# EAGLE design Adafruit Hallowing M0 Express (EAGLE 9.0.1)
COMPANY: ADAFRUIT INDUSTRIES; DRAWN: KTOWN; REV: B
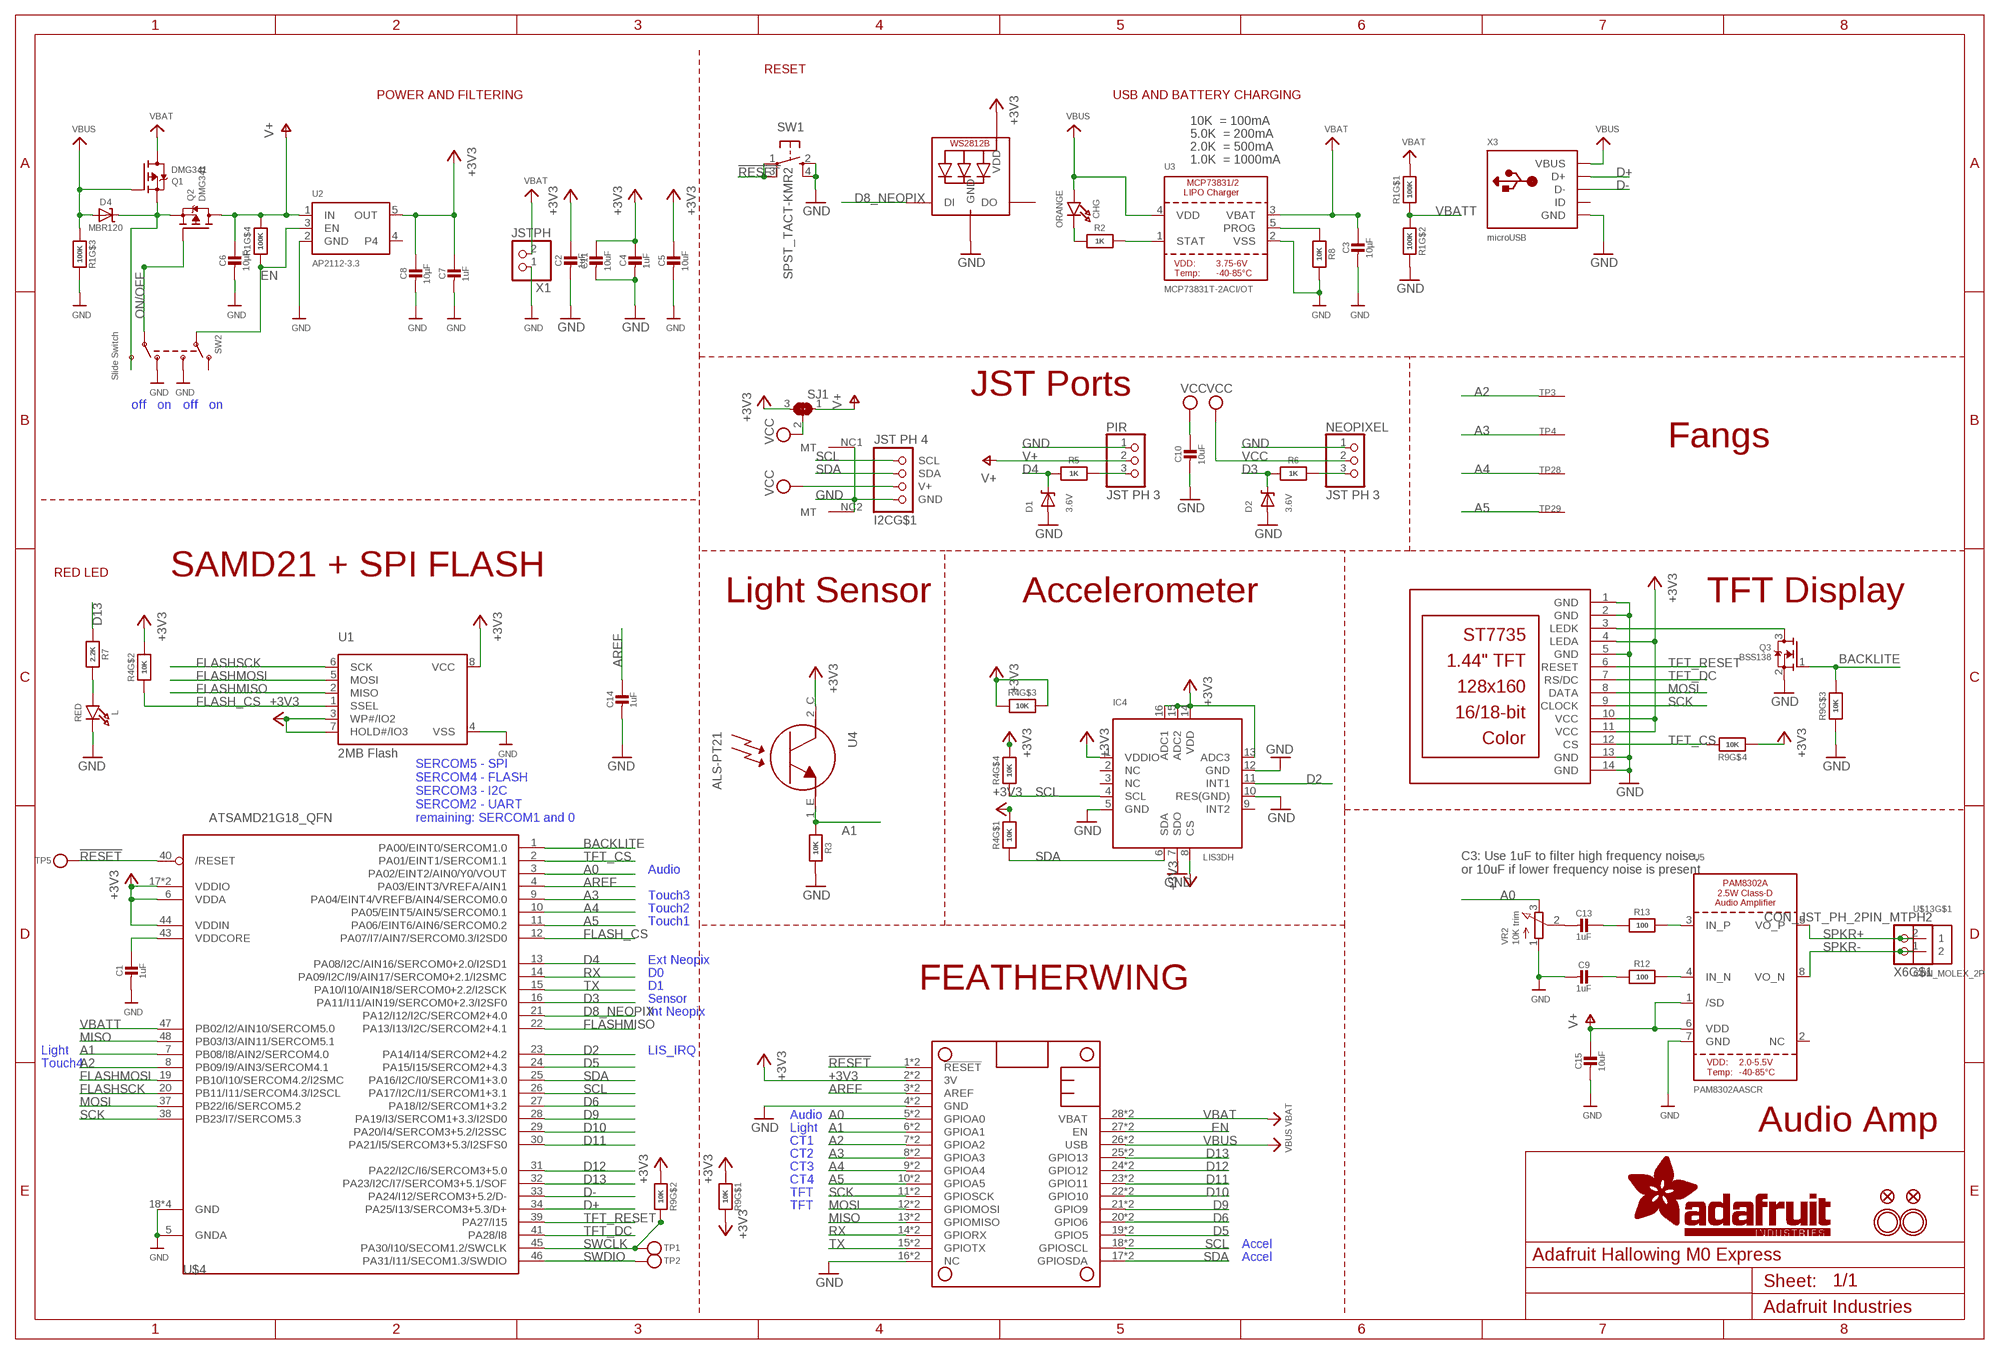
[diagram p0: schematic, sheet 1]

## Parts
C1  1uF  CAP_CERAMIC0603_NO  [0603-NO]
C2  1uF  CAP_CERAMIC0603_NO  [0603-NO]
C3  10µF  CAP_CERAMIC0805-NOOUTLINE  [0805-NO]
C4  1uF  CAP_CERAMIC0603_NO  [0603-NO]
C5  10uF  CAP_CERAMIC0805-NOOUTLINE  [0805-NO]
C6  10µF  CAP_CERAMIC0805-NOOUTLINE  [0805-NO]
C7  1uF  CAP_CERAMIC0603_NO  [0603-NO]
C8  10µF  CAP_CERAMIC0805_10MGAP  [0805_10MGAP]
C9  1uF  CAP_CERAMIC0603_NO  [0603-NO]
C10  10uF  CAP_CERAMIC0805-NOOUTLINE  [0805-NO]
C11  10uF  CAP_CERAMIC0805_10MGAP  [0805_10MGAP]
C13  1uF  CAP_CERAMIC0603_NO  [0603-NO]
C14  1uF  CAP_CERAMIC0603_NO  [0603-NO]
C15  10uF  CAP_CERAMIC0805-NOOUTLINE  [0805-NO]
CHG  ORANGE  LED0805_NOOUTLINE  [CHIPLED_0805_NOOUTLINE]
D1  3.6V  DIODE-ZENERSOD323  [SOD-323]
D2  3.6V  DIODE-ZENERSOD323  [SOD-323]
D4  MBR120  DIODE-SCHOTTKYSOD-123  [SOD-123]
I2C  JST PH 4  STEMMA_I2C_RASMT  [JSTPH4]
IC4  LIS3DH  ACCEL_LIS3DHTR  [LGA16_3X3MM]
L  RED  LED0805_NOOUTLINE  [CHIPLED_0805_NOOUTLINE]
LED1  WS2812B3535  [LED3535]
MS1  FEATHERWING_SMTDUALNOHOLES  [FEATHERWING_SMT_NOHOLES]
NEOPIXEL  JST PH 3  CON_JST_PH_3PIN  [JSTPH3]
PIR  JST PH 3  CON_JST_PH_3PIN  [JSTPH3]
Q1  DMG341  MOSFET-P  [SOT23-R]
Q2  DMG341  MOSFET-P  [SOT23-R]
Q3  BSS138  MOSFET-NWIDE  [SOT23-WIDE]
R1  100K  RESISTOR_4PACK  [RESPACK_4X0603]
R2  1K  RESISTOR_0603_NOOUT  [0603-NO]
R3  10K  RESISTOR_0603_NOOUT  [0603-NO]
R4  10K  RESISTOR_4PACK  [RESPACK_4X0603]
R5  1K  RESISTOR_0603_NOOUT  [0603-NO]
R6  1K  RESISTOR_0603_NOOUT  [0603-NO]
R7  2.2K  RESISTOR_0603_NOOUT  [0603-NO]
R8  10K  RESISTOR_0603_NOOUT  [0603-NO]
R9  10K  RESISTOR_4PACK  [RESPACK_4X0603]
R12  100  RESISTOR_0603_NOOUT  [0603-NO]
R13  100  RESISTOR_0603_NOOUT  [0603-NO]
SJ1  SOLDERJUMPER_2WAY  [SOLDERJUMPER_2WAY_OPEN_NOPASTE]
SW1  SPST_TACT-KMR2  [KMR2]
SW2  Slide Switch  SWITCH_DPDTEG1390  [EG1390]
TFT  DISP_LCD_ST7735_1.44IN  [TFT_1.44IN_128_128]
TP1  TESTPOINTROUND1.5MM  [TESTPOINT_ROUND_1.5MM]
TP2  TESTPOINTROUND1.5MM  [TESTPOINT_ROUND_1.5MM]
TP3  SEWTAP_ALLILONG  [PCB_ALLI_LONG]
TP4  SEWTAPPCB_ALLIGATOR  [PCB_ALLI]
TP5  TESTPOINTROUND1.5MM  [TESTPOINT_ROUND_1.5MM]
TP28  SEWTAPPCB_ALLIGATOR  [PCB_ALLI]
TP29  SEWTAP_ALLILONG  [PCB_ALLI_LONG]
U1  2MB Flash  SPIFLASH_8PIN208MIL  [SOIC8_208MIL]
U2  AP2112-3.3  VREG_SOT23-5  [SOT23-5]
U3  MCP73831T-2ACI/OT  MCP73831/2  [SOT23-5]
U4  ALS-PT21  PHOTOTRANSISTOR_PT26-21C  [ALS-PT26-21C]
U5  PAM8302AASCR  AUDIOAMP_PAM8302A  [MSOP8_0.65MM]
U$4  ATSAMD21G18_QFN  ATSAMD21G_QFN  [TQFN48_7MM]
U$13  CON_MOLEX_2P  [53398-0271]
U$31  MOUNTINGHOLE2.5  [MOUNTINGHOLE_2.5_PLATED]
U$32  MOUNTINGHOLE2.5  [MOUNTINGHOLE_2.5_PLATED]
U$34  FIDUCIAL_1MM  [FIDUCIAL_1MM]
U$35  FIDUCIAL_1MM  [FIDUCIAL_1MM]
VR2  10K trim  TRIMPOT3303W/X  [TRIMPOT_BOURNS_3303W]
X1  JSTPH  CON_JST_PH_2PIN  [JSTPH2]
X3  microUSB  USB_MICRO_20329_V2  [4UCONN_20329_V2]
X6  CON_JST_PH_2PIN_MTPH2  [JSTPH2]

## Nets
!RESET: MS1.1'(!RESET) MS1.1(!RESET) SW1.1(P) SW1.3(P1) TP5.P$1 U$4.40(/RESET)
+3V3 [power]: C2.1 C4.1 C5.1 C7.1 C8.1 C11.1 IC4.1(VDDIO) IC4.8(CS) IC4.13(ADC3) IC4.14(VDD) IC4.15(ADC2) IC4.16(ADC1) LED1.2(VDD) MS1.2'(3V) MS1.2(3V) R4.3 R4.5 R4.6 R4.7 R4.8 R9.1 R9.2 R9.4 R9.8 SJ1.3 TFT.4(LEDA) TFT.10(VCC) TFT.11(VCC) U1.3(WP#/IO2) U1.7(HOLD#/IO3) U1.8(VCC) U2.5(OUT) U4.2_C(C) U$4.6(VDDA) U$4.17(VDDIO) U$4.36(VDDIO) U$4.44(VDDIN)
A0: MS1.5'(GPIOA0) MS1.5(GPIOA0) U$4.3(PA02/EINT2/AIN0/Y0/VOUT) VR2.3(E)
A1: MS1.6'(GPIOA1) MS1.6(GPIOA1) R3.2 U4.1_E(E) U$4.7(PB08/I8/AIN2/SERCOM4.0)
A2: MS1.7'(GPIOA2) MS1.7(GPIOA2) TP3.P$1(SEW) U$4.8(PB09/I9/AIN3/SERCOM4.1)
A3: MS1.8'(GPIOA3) MS1.8(GPIOA3) TP4.P$1(SEW) U$4.9(PA04/EINT4/VREFB/AIN4/SERCOM0.0)
A4: MS1.9'(GPIOA4) MS1.9(GPIOA4) TP28.P$1(SEW) U$4.10(PA05/EINT5/AIN5/SERCOM0.1)
A5: MS1.10'(GPIOA5) MS1.10(GPIOA5) TP29.P$1(SEW) U$4.11(PA06/EINT6/AIN6/SERCOM0.2)
AREF: C14.1 MS1.3'(AREF) MS1.3(AREF) U$4.4(PA03/EINT3/VREFA/AIN1)
BACKLITE: Q3.1(G) R9.6 U$4.1(PA00/EINT0/SERCOM1.0)
CHG_LED: R2.2 U3.1(STAT)
CHG_RATE: R8.1 U3.5(PROG)
D2: IC4.11(INT1) U$4.23(PA14/I14/SERCOM2+4.2)
D3: D2.C R6.2 U$4.16(PA11/I11/AIN19/SERCOM0+2.3/I2SF0)
D4: D1.C R5.2 U$4.13(PA08/I2C/AIN16/SERCOM0+2.0/I2SD1)
D5: MS1.19'(GPIO5) MS1.19(GPIO5) U$4.24(PA15/I15/SERCOM2+4.3)
D6: MS1.20'(GPIO6) MS1.20(GPIO6) U$4.27(PA18/I2/SERCOM1+3.2)
D8_NEOPIX: LED1.1(DI) U$4.21(PA12/I12/I2C/SERCOM2+4.0)
D9: MS1.21'(GPIO9) MS1.21(GPIO9) U$4.28(PA19/I3/SERCOM1+3.3/I2SD0)
D10: MS1.22'(GPIO10) MS1.22(GPIO10) U$4.29(PA20/I4/SERCOM3+5.2/I2SSC)
D11: MS1.23'(GPIO11) MS1.23(GPIO11) U$4.30(PA21/I5/SERCOM3+5.3/I2SFS0)
D12: MS1.24'(GPIO12) MS1.24(GPIO12) U$4.31(PA22/I2C/I6/SERCOM3+5.0)
D13: MS1.25'(GPIO13) MS1.25(GPIO13) R7.1 U$4.32(PA23/I2C/I7/SERCOM3+5.1/SOF)
D+: U$4.34(PA25/I13/SERCOM3+5.3/D+) X3.D+
D-: U$4.33(PA24/I12/SERCOM3+5.2/D-) X3.D-
EN: MS1.27'(EN) MS1.27(EN) R1.4 SW2.P1 U2.3(EN)
FLASH_CS: R4.2 U1.1(SSEL) U$4.12(PA07/I7/AIN7/SERCOM0.3/I2SD0)
FLASHMISO: U1.2(MISO) U$4.22(PA13/I13/I2C/SERCOM2+4.1)
FLASHMOSI: U1.5(MOSI) U$4.19(PB10/I10/SERCOM4.2/I2SMC)
FLASHSCK: U1.6(SCK) U$4.20(PB11/I11/SERCOM4.3/I2SCL)
GND: C1.2 C2.2 C3.2 C4.2 C5.2 C6.2 C7.2 C8.2 C9.2 C10.2 C11.2 C14.2 C15.2 D1.A D2.A I2C.1(GND) I2C.NC1(MT) I2C.NC2(MT) IC4.5(GND) IC4.7(SDO) IC4.10(RES(GND)) IC4.12(GND) L.C LED1.4(GND) MS1.4'(GND) MS1.4(GND) MS1.16'(NC) MS1.16(NC) NEOPIXEL.1 PIR.1 Q3.2(S) R1.6 R1.7 R3.1 R8.2 R9.3 SW1.2(S) SW1.4(S1) SW2.O2 SW2.S1 TFT.1(GND) TFT.2(GND) TFT.5(GND) TFT.13(GND) TFT.14(GND) U1.4(VSS) U2.2(GND) U3.2(VSS) U5.7(GND) U$4.5(GNDA) U$4.18(GND) U$4.35(GND) U$4.42(GND) U$4.THERMAL(GND) VR2.1(A) X1.1 X3.BASE@1(GND) X3.BASE@2(GND) X3.GND X3.SPRT@1(GND) X3.SPRT@2(GND) X3.SPRT@3(GND) X3.SPRT@4(GND)
MISO: MS1.13'(GPIOMISO) MS1.13(GPIOMISO) U$4.48(PB03/I3/AIN11/SERCOM5.1)
MOSI: MS1.12'(GPIOMOSI) MS1.12(GPIOMOSI) TFT.8(DATA) U$4.37(PB22/I6/SERCOM5.2)
N$1: CHG.C R2.1
N$2: L.A R7.2
N$6: Q3.3(D) TFT.3(LEDK)
N$8: D4.C Q1.2(S) Q2.2(S) SW2.S2
N$19: R12.2 U5.4(IN_N)
N$20: R13.2 U5.3(IN_P)
N$21: C9.1 R12.1
N$22: C13.1 R13.1
N$23: C13.2 VR2.2(S)
NEOPIXELOUT: NEOPIXEL.3 R6.1
ON/OFF: Q2.1(G) SW2.P2
RX: MS1.14'(GPIORX) MS1.14(GPIORX) U$4.14(PA09/I2C/I9/AIN17/SERCOM0+2.1/I2SMC)
SCK: MS1.11'(GPIOSCK) MS1.11(GPIOSCK) TFT.9(CLOCK) U$4.38(PB23/I7/SERCOM5.3)
SCL: I2C.4(SCL) IC4.4(SCL) MS1.18'(GPIOSCL) MS1.18(GPIOSCL) R4.4 U$4.26(PA17/I2C/I1/SERCOM1+3.1)
SDA: I2C.3(SDA) IC4.6(SDA) MS1.17'(GPIOSDA) MS1.17(GPIOSDA) R4.1 U$4.25(PA16/I2C/I0/SERCOM1+3.0)
SENSORIN: PIR.3 R5.1
SPKR+: U5.5(VO_P) U$13.1 X6.2
SPKR-: U5.8(VO_N) U$13.2 X6.1
SWCLK: R9.7 TP1.P$1 U$4.45(PA30/I10/SECOM1.2/SWCLK)
SWDIO: TP2.P$1 U$4.46(PA31/I11/SECOM1.3/SWDIO)
TFT_CS: R9.5 TFT.12(CS) U$4.2(PA01/EINT1/SERCOM1.1)
TFT_DC: TFT.7(RS/DC) U$4.41(PA28/I8)
TFT_RESET: TFT.6(RESET) U$4.39(PA27/I15)
TX: MS1.15'(GPIOTX) MS1.15(GPIOTX) U$4.15(PA10/I10/AIN18/SERCOM0+2.2/I2SCK)
V+ [power]: C6.1 C15.1 PIR.2 Q2.3(D) R1.5 SJ1.1 U2.1(IN) U5.1(/SD) U5.6(VDD)
VBAT [power]: C3.1 MS1.28'(VBAT) MS1.28(VBAT) Q1.3(D) R1.8 U3.3(VBAT) X1.2
VBATT: R1.1 R1.2 U$4.47(PB02/I2/AIN10/SERCOM5.0)
VBUS [power]: CHG.A D4.A MS1.26'(USB) MS1.26(USB) Q1.1(G) R1.3 U3.4(VDD) X3.VBUS
VCC [power]: C10.1 I2C.2(V+) NEOPIXEL.2 SJ1.2
VDDCORE: C1.1 U$4.43(VDDCORE)
Unconnected: IC4.2(NC) IC4.3(NC) IC4.9(INT2) LED1.3(DO) SW2.O1 U2.4 U5.2(NC) U$13.M1(MT) U$13.M2(MT) X3.ID X6.NC1 X6.NC2

## Notes on the sheet
- RESET
- POWER AND FILTERING | USB AND BATTERY CHARGING
- 10K  = 100mA
- 5.0K  = 200mA
- 2.0K  = 500mA
- 1.0K  = 1000mA
- JST Ports
- off | on | off | on
- Fangs
- RED LED | SAMD21 + SPI FLASH
- Light Sensor | Accelerometer | TFT Display
- SERCOM5 - SPI
  SERCOM4 - FLASH
  SERCOM3 - I2C
  SERCOM2 - UART
  remaining: SERCOM1 and 0
- Audio
- C3: Use 1uF to filter high frequency noise,
  or 10uF if lower frequency noise is present
- Touch3
- Touch2
- Touch1
- Ext Neopix
- D0
- D1 | FEATHERWING
- Sensor
- Int Neopix
- Light | LIS_IRQ
- Touch4
- Audio
- Light | Audio Amp
- CT1
- CT2
- CT3
- CT4
- TFT
- TFT
- Accel
- Accel

## Library data of the parts
C1-C11 C13-C15 = microbuilder:CAP_CERAMIC: Ceramic Capacitors For new designs, use the packages preceded by an '_' character since they are more reliable: The following footprints should be used on most boards: _0402 - Standard footprint for regular board layouts _0603 - Standard footprint for regular board layouts _0805 - Standard footprint for regular board layouts _1206 - Standard footprint for regular board layouts For extremely tight-pitch boards where space is at a premium, the following 'micro-pitch' footprints can be used (smaller pads, no silkscreen outline, etc.): _0402MP - Micro-pitch footprint for very dense/compact boards _0603MP - Micro-pitch footprint for very dense/compact boards _0805MP - Micro-pitch footprint for very dense/compact boards _1206MP - Micro-pitch footprint for very dense/compact boards
CHG L = microbuilder:LED: LED 0603 - 0603 Surface Mount Package 2mA: Green LED - Low Power (3.9mcd, 2ma, 1.7Vf) - Digikey: 475-2709-2-ND Orange LED - Low Power (9.8mcd, 2ma, 1.8Vf) - Digikey: 475-1194-2-ND Red LED - Low Power (5mcd, 2ma, 1.8Vf) - Digikey: 475-1195-2-ND Yellow LED - Low Power (7mcd, 2ma, 1.8Vf) - Digikey: 475-1196-2-ND 5mA: Blue LED - Low Power (17mcd, 5ma, 2.9Vf) - Digikey: LNJ937W8CRACT-ND 0805 - 0805 Surface Mount Package 2mA: Red LED (8.8mcd, 2mA, 1.8Vf, Clear) - Low Power [Digikey: 475-2510-1-ND] Green LED (5mcd, 2mA, 1.8Vf, Clear) - Low Power [Digikey: 475-2730-1-ND] Yellow LED (11.3mcd, 2mA, 1.8Vf, Clear) - Low Power [Digikey: 475-2555-1-ND] 20mA: Red LED (104mcd, 20mA, Diffused) - LS R976 [Digikey: 475-1278-6-ND] Red LED (12mcd, 20mA, 2.0Vf, Clear) - APT2012EC [Digikey: 754-1128-1-ND] Green LED (15mcd, 20mA, 2.2Vf, Clear) - APT2012GC [Digikey: 754-1131-1-ND] Orange LED (160mcd, 20mA, 2.1Vf, Clear) - APT2012SECK [Digikey: 754-1130-1-ND] 1206 - 1206 Surface Mount Package Green LED (26mcd, 20mA, Diffused) - LG N971 [Digikey: 475-1407-6-ND] Red LED (15mcd, 20mA, Diffused) - LH N974 [Digikey: 475-1416-6-ND] Cree - Cree High-Power Surface Mount LEDs XPEBWT-L1-0000-00D50 - White 111lm 350mA 2.9Vf 6200K 110° XTEAWT-00-0000-00000LEE3 - White 114lm 350mA 2.85Vf 5000K 115° Everlight - Everlight 45-21 Series Surface Mount LEDs 45-21/QK2C-B2832AC2CB2/2T - Warm White 2000mcd 20mA 3.25Vf 3050K 120° 45-21/LK2C-B38452C4CB2/2T - Nuetral White 2000mcd 20mA 3.25Vf 4150K 120° 45-21/LK2C-B50634C6CB2/2T - Cold White 2200mcd 20mA 3.25Vf 5650K 120° PLCC2 Reverse Mount LS T77K-J1L2-1-0-2-R18-Z - Red 11.25mcd 2mA 1.8Vf 630nm 120° LO T77K-L1M2-24-Z - Orange 19.6mcd 2mA 1.8Vf 606nm 120° LY T77K-K2M1-26-Z - Yellow 15.7mcd 2mA 1.8Vf 587nm 120°
D1 D2 = microbuilder:DIODE-ZENER: Zener Diode SMA: 30V 1W Zener Diode, 1.2Vf - Digikey: SMAZ30-FDICT-ND
D4 = microbuilder:DIODE-SCHOTTKY
I2C = microbuilder:STEMMA_I2C
IC4 = microbuilder:ACCEL_LIS3DHTR: LIS3DHTR 3-Axis Accelerometer with I2C/SPI Interface VDD: 1.71-3.6V VDDIO: 1.71-VDD+0.1V Scale: +/-2g, 4g, 8g, 16g with 16--bit data output Temp:: -40°C - 85°C Mouser: 511-LIS3DHTR Digikey: 497-10613-1-ND
LED1 = microbuilder:WS2812B
MS1 = microbuilder:FEATHERWING
NEOPIXEL PIR = microbuilder:CON_JST_PH_3PIN
Q1 Q2 = microbuilder:MOSFET-P: P-Channel Mosfet LEGEND VDS: Voltage Drain-Source ID: Drain Current RDS(ON): Drain-Source On-State Resistance VGS(TH): Gate-Source Threshold Voltage CISS: Drain-Source Input Capacitance SOT-23 Name VDS ID RDS(ON) VGS(TH) CISS Order Number IRLML5103 30V 760mA 600 mOhm -- 75pF @ 25V Digikey: IRLML5103PBFCT-ND IRLML6401 12V 4.3A 50 mOhm 950mV @ 250µA 830pF @ 10V Digikey: IRLML6401PBFTR-ND NTR0202PL 20V 400mA 800 mOhm 2.3V @ 250uA 70pF @ 5V Digikey: NTR0202PLT1GOSTR-ND NTR4101PT1G 20V 1.8A 85 mOhm 1.2V @ 250uA 675pF @ 10V Digikey: NTR4101PT1GOSCT-ND DMP2004K 20V 600mA 900 mOhm 1V @ 250uA 175pF @ 16V Digikey: DMP2004KDICT-ND PMV65XP 20V 3.9A 76 mOhm 950mV @ 1mA 725pF @ 20V Digikey: 568-2358-2-ND TO-252 Name VDS ID RDS(ON) VGS(TH) CISS Order Number AOD417 30V 25A 34 mOhm 3V @ 250µA 920pF @ 15V Digikey: 785-1106-2-ND PowerPak Name VDS ID RDS(ON) VGS(TH) CISS Order Number AON7401 30V 12A 14 mOhm 3V @ 250µA 2600pF @ 15V Digikey: 785-1302-1-ND
Q3 = microbuilder:MOSFET-N: N-Channel Mosfet LEGEND VDS: Voltage Drain-Source ID: Drain Current RDS(ON): Drain-Source On-State Resistance VGS(TH): Gate-Source Threshold Voltage CISS: Drain-Source Input Capacitance SOT-23 Name VDS ID RDS(ON) VGS(TH) CISS Order Number 2N7002E 60V 260mA 2.5 Ohm 2.5V @ 250uA 26.7pF @ 25V 2N7002ET1GOSTR-ND BSH103 30V 850mA 400 mOhm 400mV @ 1mA 83pF @ 24V BSH103,235-ND BSS138 60V 320mA 1.6 Ohm 1.5V @ 250uA 50pF @ 10V Mouser: 771-BSS138PW115 DMN2075U-7 20V 4.2A 38 mOhm 1V @ 250 uA 594.3pF @ 10V DMN2075U-7DICT-ND * BSS138 good choice for I2C level-shifting POWERPAK 1212-8 Name VDS ID RDS(ON) VGS(TH) CISS Order Number Si7308DN 60V 6A 58 mOhm 3V @ 250uA 665pF @ 15V SI7308DN-T1-E3CT-ND
R1 R4 R9 = microbuilder:RESISTOR_4PACK: Resistor Packs (4 resistors) 4 x 0603 10K 1/16W - Digikey: YC164J-10KCT-ND
R2 R3 R5-R8 R12 R13 = microbuilder:RESISTOR: Resistors For new designs, use the packages preceded by an '_' character since they are more reliable: The following footprints should be used on most boards: _0402 - Standard footprint for regular board layouts _0603 - Standard footprint for regular board layouts _0805 - Standard footprint for regular board layouts _1206 - Standard footprint for regular board layouts For extremely tight-pitch boards where space is at a premium, the following 'micro-pitch' footprints can be used (smaller pads, no silkscreen outline, etc.): _0402MP - Micro-pitch footprint for very dense/compact boards _0603MP - Micro-pitch footprint for very dense/compact boards _0805MP - Micro-pitch footprint for very dense/compact boards _1206MP - Micro-pitch footprint for very dense/compact boards
SJ1 = microbuilder:SOLDERJUMPER_2WAY: 2-Way Solder Jumper
SW1 = adafruit:SPST_TACT: SMT 6mm switch, EVQQ2 series http://www.ladyada.net/library/eagle
SW2 = microbuilder:SWITCH_DPDT: Switch - DPDT A DPDT Switch acts like an SPDT switch, but has a pair of switches instead of just one. Vertical - 0.3A @ 6V SMT - Digikey: JS202011SCQN
TFT = microbuilder:DISP_LCD_ST7735_1.44IN
TP1 TP2 TP5 = microbuilder:TESTPOINT: Test Point Various test points for characterisation and PCB testing TESTPOINT_SMT - Compact Surface Mount Test Point [Digikey: 5016KTR-ND]
TP3 TP4 TP28 TP29 = microbuilder:SEWTAP
U1 = microbuilder:SPIFLASH_8PIN: SOIC8 SPI Flash Be careful with the size since SOIC8 flash comes in several 'widths' SOIC8 150 mil M25P16 - 16Mbit (2Mbit x 8) Serial Flash (75MHz SPI Bus), Supply: 2.7-3.6V Digikey: SOIC8 - M25P16-VMN6P-ND SOIC8 208 mil W25Q16BVSSIG - 16Mbit (2Mbit x 8) Serial Flash (104MHz SPI Bus), Supply: 2.7-3.6V Digikey: SOIC8 - W25Q16BVSSIG-ND
U2 = microbuilder:VREG_SOT23-5: SOT23-5 Fixed Voltage Regulators Part Current Out V Out V In V Dropout θJA (°C/W) TJ (°C) Digikey Part No. ADP121 150mA 3.3V 3.4-5.5V 0.09V @ 150mA -- -- ADP121-AUJZ33R7CT-ND ADP121 150mA 3.0V 3.1-5.5V 0.09V @ 150mA -- -- ADP121-AUJZ30R7CT-ND ADP122 300mA 3.3V 3.4-5.5V 0.085V @ 300mA -- -- ADP122AUJZ-3.3-R7CT-ND ADP1712 300mA 3.3V 3.5-5.5V 0.17V @ 300mA -- -- ADP1712AUJZ-3.3-R7TR-ND AP7311 (Low Cost) 150mA 3.3V 3.5-6V 0.15V @ 150mA -- -- AP7311-33WG-7DICT-ND LD39015M18R 150mA 1.8V 1.9V-5.5V 0.08V @ 100mA -- -- 497-6977-1-ND LP2985A-33DBVR 150mA 3.3V 3.3-16V 0.28V @ 150mA 206 150 296-18479-1-ND MCP1824T-3302E/OT 300mA 3.3V 3.5V-6V 0.2V @ 300mA -- -- MCP1824T-3302E/OTCT-ND MIC5205-2.5YM5 TR 150mA 2.5V 2.7-16V 0.165V @ 150mA -- -- 576-1257-2-ND MIC5205-3.0YM5 TR 150mA 3.0V 3.2V-16V 0.165V @ 150mA -- -- 576-1258-2-ND MIC5205-3.3YM5 TR 150mA 3.3V 3.5V-16V 0.165V @ 150mA -- -- 576-1259-2-ND TPS780330220 150mA 3.3V+2.2V 3.6-5.5V 250mV Max -- -- 296-23332-1-ND TDA3663/N1,135 100mA 3.3V 3.5-45V 0.18V @ 50mA -- -- 568-5343-1-ND Max operating temp can be calculated using θJA, TJ (max junction temperature), and power in watts. Set the "Maximum Ambient Temperature" until it reaches TJ ("Max Junction Temperature"), which is the absolute limit for safe use of the regulator: Heat Sink Temperature Calculator <http://www.daycounter.com/Calculators/Heat-Sink-Temperature-Calculator.phtml> For example, With 12V source into a 3.3V LP2985 and a 30mA load, we are dissipating (12V-3.3V) * 0.03A = 0.261W. With a θJA of 206 °C/W, a TJ of 150°C, and 261mW we can safely use the chip without a heat sink up to 75°C (=147.1°C Junction Temperature).
U3 = microbuilder:MCP73831/2: MCP73831/2 LIPO Charger VDD: 3.75 - 6V Temp -40 - 85°C Programmable Charge Rate: 15-500mA NOTE: STAT is a tri-state logic output on the MCP73831 and an open-drain output on the MCP73832. SOT23-5 with 4.2V output and tri-state logic on STAT = MCP73831T-2ACI/OT
U4 = microbuilder:PHOTOTRANSISTOR: ALS-PT19-315C - Analog Light Sensor VCC: 2.5-5.5V
U5 = microbuilder:AUDIOAMP_PAM8302A: PAM8302A - 2.5W Class-D Mono Audio Amplifier MSOP8 = PAM8302AASCR
U$4 = microbuilder:ATSAMD21G
U$13 = microbuilder:CON_MOLEX_2P
U$31 U$32 = microbuilder:MOUNTINGHOLE: Mounting Hole For #2 screws (0.086"/2.18mm width, 0.094"/2.4mm hole) use 2.5mm; BOM: EXCLUDE
U$34 U$35 = microbuilder:FIDUCIAL: Fiducial Alignment Points Various fiducial points for machine vision alignment.; BOM: EXCLUDE
VR2 = microbuilder:TRIMPOT: 3-Pin SMT Trimpots Bourns TC33 (X-2) Series 1K - Digikey: TC33X-102ECT-ND 10K - Digikey: TC33X-2-103E 100K - Digikey: TC33X-104ECT-ND Bourns 3303 (W) Series 3mm 10K Single Turn - Digikey: 3303W-103ETR-ND 3mm 100K Single Turn - Digikey: 3303X-104ETR-ND
X1 = microbuilder:CON_JST_PH_2PIN: JST 2-Pin Right-Angle Connector PH-Series - 4UConnector: 17311 SH-Series - 4UConnector: 07278
X3 = microbuilder:USB: USB Connectors USBMINIB - Surface Mount Female Mini-B USB Connector 4UConnector: 06564
X6 = microbuilder:CON_JST_PH_2PIN_MT

## Net classes
1 power: width 0.305 mm
2 thickpower: width 0.406 mm

## Board
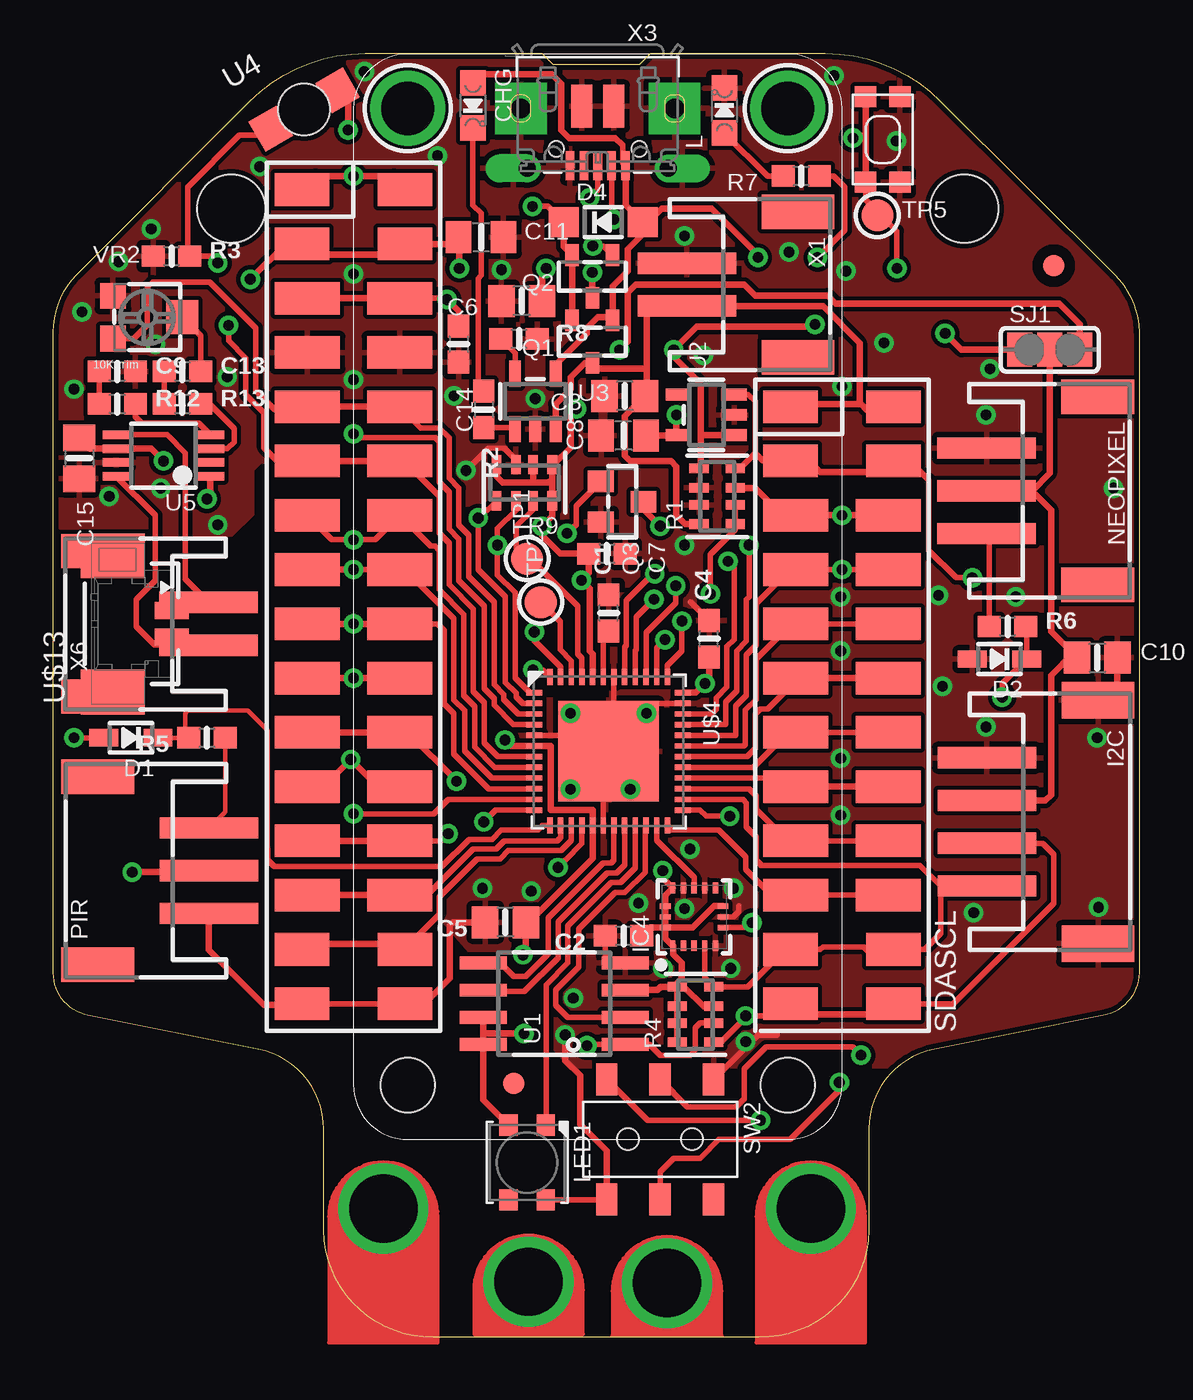
[diagram p1: board, top side]
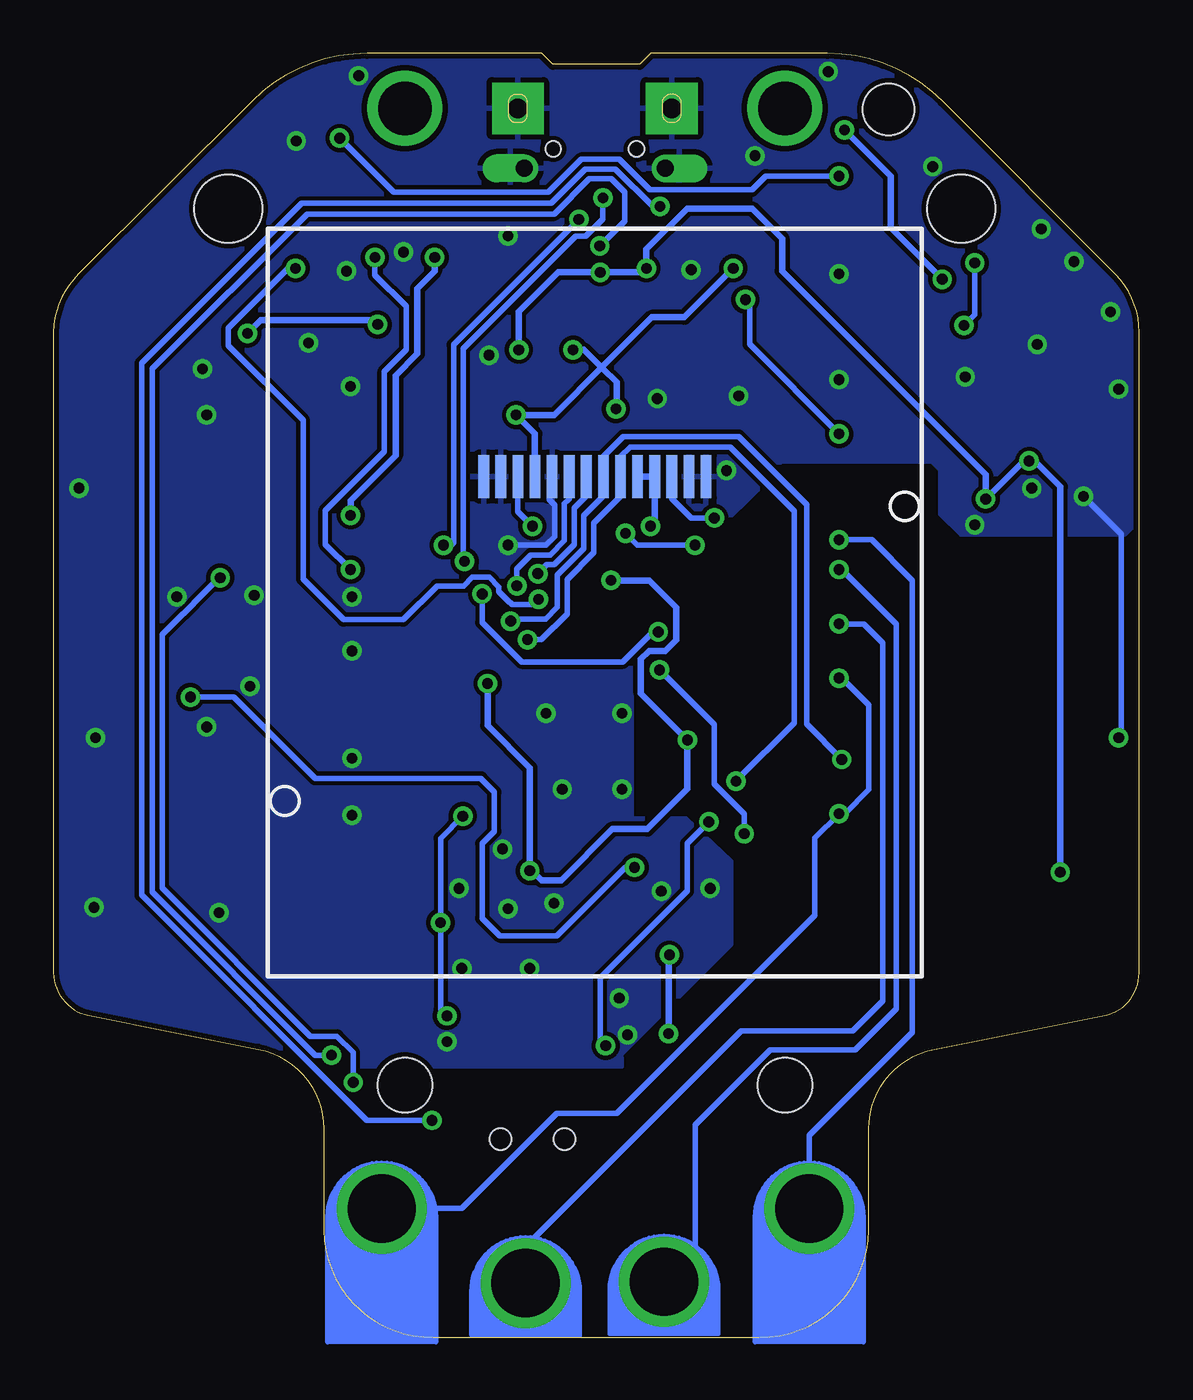
[diagram p2: board, bottom side, seen from below]

Size 50.8 x 60.1 mm. Coordinates in mm from the lower left corner, seen from the top.
Copper layers (1*16): Top 0.035mm / dielectric 1.5mm / Bottom 0.035mm
Design rules "adafruit *": minimum track width 8mil, minimum drill 15.5mil, track to track 8mil, track to pad 8mil, pad to pad 8mil, via to via 8mil, smd to smd 8mil, copper to edge 10mil, drill to drill 8mil, minimum pad ring 10mil, minimum via ring 8mil, stop-mask expansion 2mil, vias tented up to drill 20mil, thermal gap 10mil
Holes 2.54 mm at 34.36,11.81 16.58,11.81
Holes 3.17 mm at 8.32,52.83 42.61,52.83
tRestrict: area 23.2,30 to 26,30.3; area 28.5,24.5 to 28.9,29.5; area 26,24.5 to 28.5,25

### Footprints (pad centres in the part's own frame; a part is rotated, then mirrored left to right if it is on the bottom)
0603-NO = smd 1.075 x 1: 1 -0.85,0; 2 0.85,0
0805-NO = smd 1.24 x 1.5: 1 -0.95,0; 2 0.95,0
0805_10MGAP = smd 1.2 x 1.5: 1 -1.05,0; 2 1.05,0
CHIPLED_0805_NOOUTLINE = smd 1.2 x 1.2: A 0,-1.05; C 0,1.05
SOD-323 = smd 1.35 x 0.8: A 1.27,0; C -1.27,0
SOD-123 = smd 1.4 x 1.4: A 1.85,0; C -1.85,0
JSTPH4 = smd 1 x 4.6: 1 -3,-3.7; 2 -1,-3.7; 3 1,-3.7; 4 3,-3.7 | smd 1.7 x 3.4: NC1 -5.7,1.5; NC2 5.7,1.5
LGA16_3X3MM = smd 0.5 x 0.25: 1 -1.35,1; 2 -1.35,0.5; 3 -1.35,0; 4 -1.35,-0.5; 5 -1.35,-1; 9 1.35,-1; 10 1.35,-0.5; 11 1.35,0; 12 1.35,0.5; 13 1.35,1 | smd 0.25 x 0.5: 6 -0.5,-1.35; 7 0,-1.35; 8 0.5,-1.35; 14 0.5,1.35; 15 0,1.35; 16 -0.5,1.35
LED3535 = smd 1 x 0.85: 1 -1.75,0.875; 2 -1.75,-0.875; 3 1.75,-0.875; 4 1.75,0.875
FEATHERWING_SMT_NOHOLES = smd 1.524 x 2.54: 1 6.35,2.413; 1' 6.35,-2.413; 2 8.89,2.413; 2' 8.89,-2.413; 15 41.91,2.413; 15' 41.91,-2.413; 16 44.45,2.413; 16' 44.45,-2.413; 17 44.45,20.447; 17' 44.45,25.273; 18 41.91,20.447; 18' 41.91,25.273; 27 19.05,20.447; 27' 19.05,25.273; 28 16.51,20.447; 28' 16.51,25.273 | smd 1.524 x 3.048: 3 11.43,2.159; 3' 11.43,-2.159; 4 13.97,2.159; 4' 13.97,-2.159; 5 16.51,2.159; 5' 16.51,-2.159; 6 19.05,2.159; 6' 19.05,-2.159; 7 21.59,2.159; 7' 21.59,-2.159; 8 24.13,2.159; 8' 24.13,-2.159; 9 26.67,2.159; 9' 26.67,-2.159; 10 29.21,2.159; 10' 29.21,-2.159; 11 31.75,2.159; 11' 31.75,-2.159; 12 34.29,2.159; 12' 34.29,-2.159; 13 36.83,2.159; 13' 36.83,-2.159; 14 39.37,2.159; 14' 39.37,-2.159; 19 39.37,20.701; 19' 39.37,25.019; 20 36.83,20.701; 20' 36.83,25.019; 21 34.29,20.701; 21' 34.29,25.019; 22 31.75,20.701; 22' 31.75,25.019; 23 29.21,20.701; 23' 29.21,25.019; 24 26.67,20.701; 24' 26.67,25.019; 25 24.13,20.701; 25' 24.13,25.019; 26 21.59,20.701; 26' 21.59,25.019
JSTPH3 = smd 1 x 4.6: 1 -2,-2.7; 2 0,-2.7; 3 2,-2.7 | smd 1.6 x 3.4: NC1 -4.4,2.5; NC2 4.4,2.5
SOT23-R = smd 0.635 x 1.016: 1 -0.95,-1; 2 0.95,-1; 3 0,1
SOT23-WIDE = smd 1 x 1.2: 1 -0.95,-1; 2 0.95,-1; 3 0,1
RESPACK_4X0603 = smd 0.45 x 0.9: 1 -1.3,-0.85; 2 -0.4,-0.85; 3 0.4,-0.85; 4 1.3,-0.85; 5 1.3,0.85; 6 0.4,0.85; 7 -0.4,0.85; 8 -1.3,0.85
SOLDERJUMPER_2WAY_OPEN_NOPASTE = smd 1.168 x 1.6: 1 -1.397,0; 2 0,0; 3 1.397,0
KMR2 = smd 1 x 1: 1 2,0.8; 2 2,-0.8; 3 -2,0.8; 4 -2,-0.8
EG1390 = smd 1 x 1.5: O1 -2.5,2.8; O2 -2.5,-2.8; P1 0,2.8; P2 0,-2.8; S1 2.5,2.8; S2 2.5,-2.8 | hole 1: 1.5,0; -1.5,0
TFT_1.44IN_128_128 = smd 0.5 x 2: 1 5.2,12.855; 2 4.4,12.855; 3 3.6,12.855; 4 2.8,12.855; 5 2,12.855; 6 1.2,12.855; 7 0.4,12.855; 8 -0.4,12.855; 9 -1.2,12.855; 10 -2,12.855; 11 -2.8,12.855; 12 -3.6,12.855; 13 -4.4,12.855; 14 -5.2,12.855
TESTPOINT_ROUND_1.5MM = smd 1.5 x 1.5: P$1 0,0
PCB_ALLI_LONG = drill 3.2: P$1 0,0.508
PCB_ALLI = drill 3.2: P$1 0,0.508
SOIC8_208MIL = smd 0.6 x 2.2: 1 -1.905,-3.315; 2 -0.635,-3.315; 3 0.635,-3.315; 4 1.905,-3.315; 5 1.905,3.315; 6 0.635,3.315; 7 -0.635,3.315; 8 -1.905,3.315
SOT23-5 = smd 0.55 x 1.2: 1 -0.95,-1.3; 2 0,-1.3; 3 0.95,-1.3; 4 0.95,1.3; 5 -0.95,1.3
ALS-PT26-21C = smd 1.5 x 1.6: 1_E -1.8,0; 2_C 1.8,0 | hole 2.4: 0,0
MSOP8_0.65MM = smd 0.4 x 1.3: 1 -0.975,-2.2; 2 -0.325,-2.2; 3 0.325,-2.2; 4 0.975,-2.2; 5 0.975,2.2; 6 0.325,2.2; 7 -0.325,2.2; 8 -0.975,2.2
TQFN48_7MM = smd 0.25 x 0.75: 1 -2.75,-3.475; 2 -2.25,-3.475; 3 -1.75,-3.475; 4 -1.25,-3.475; 5 -0.75,-3.475; 6 -0.25,-3.475; 7 0.25,-3.475; 8 0.75,-3.475; 9 1.25,-3.475; 10 1.75,-3.475; 11 2.25,-3.475; 12 2.75,-3.475; 25 2.75,3.475; 26 2.25,3.475; 27 1.75,3.475; 28 1.25,3.475; 29 0.75,3.475; 30 0.25,3.475; 31 -0.25,3.475; 32 -0.75,3.475; 33 -1.25,3.475; 34 -1.75,3.475; 35 -2.25,3.475; 36 -2.75,3.475 | smd 0.75 x 0.25: 13 3.475,-2.75; 14 3.475,-2.25; 15 3.475,-1.75; 16 3.475,-1.25; 17 3.475,-0.75; 18 3.475,-0.25; 19 3.475,0.25; 20 3.475,0.75; 21 3.475,1.25; 22 3.475,1.75; 23 3.475,2.25; 24 3.475,2.75; 37 -3.475,2.75; 38 -3.475,2.25; 39 -3.475,1.75; 40 -3.475,1.25; 41 -3.475,0.75; 42 -3.475,0.25; 43 -3.475,-0.25; 44 -3.475,-0.75; 45 -3.475,-1.25; 46 -3.475,-1.75; 47 -3.475,-2.25; 48 -3.475,-2.75 | smd 4.7 x 4.7: THERMAL 0,0
53398-0271 = smd 0.8 x 1.6: 1 0.625,-1.27; 2 -0.625,-1.27 | smd 2.1 x 3: M1 3.185,1.48; M2 -3.185,1.48
MOUNTINGHOLE_2.5_PLATED = drill 2.5 pad 3.2: P$1 0,0
FIDUCIAL_1MM = smd 1 x 1: 1 0,0
TRIMPOT_BOURNS_3303W = smd 1.2 x 1.2: 1 -1,-1.6; 3 1,-1.6 | smd 1.6 x 1.5: 2 0,1.65
JSTPH2 = smd 1 x 4.6: 1 -1,-3.7; 2 1,-3.7 | smd 1.6 x 3.4: NC1 -3.4,1.5; NC2 3.4,1.5
4UCONN_20329_V2 = smd 1 x 2: BASE@1 -0.75,-2; BASE@2 0.75,-2 | smd 0.4 x 1.35: D+ 0,0.775; D- -0.65,0.775; GND 1.3,0.775; ID 0.65,0.775; VBUS -1.3,0.775 | drill 0.8 pad 1.143 offset: SPRT@1 -3.3,0.9; SPRT@2 3.3,0.9 | drill 0.9 pad 2.413 square: SPRT@3 -3.6,-1.9; SPRT@4 3.6,-1.9 | hole 0.7: -1.95,0; 1.95,0

### Placement (x,y rotation side)
C1  25.98,33.91 90 top
C2  26.68,18.79 180 top
C3  26.74,44.07 180 top
C4  30.68,32.7 90 top
C5  21.15,19.43 180 top
C6  21.91,48.51 180 top
C7  25.9,36.68 0 top
C8  26.68,42.21 180 top
C9  2.99,45.21 0 top
C10  48.84,31.81 0 top
C11  20.01,51.5 0 top
C13  6.04,45.21 0 top
C14  18.95,46.49 270 top
C15  1.21,41.14 270 top
CHG  19.63,57.65 180 top
D1  3.62,28.06 180 top
D2  44.26,31.75 180 top
D4  25.72,52.19 0 top
I2C  47.38,24.13 270 top
IC4  29.98,19.68 90 top
L  31.4,57.42 0 top
LED1  22.17,8.19 270 top
MS1  14.04,60.07 270 top
NEOPIXEL  46.36,39.62 270 top
PIR  4.58,21.84 90 top
Q1  25.21,46.61 180 top
Q2  25.21,49.65 180 top
Q3  26.61,39.11 270 top
R1  31.06,39.37 90 top
R2  20.13,43.43 270 top
R3  5.53,50.61 0 top
R4  30.04,15.11 90 top
R5  7.18,28.06 180 top
R6  44.65,33.27 0 top
R7  34.99,54.35 180 top
R8  21.79,46.73 0 top
R9  22.04,40 180 top
R12  2.99,43.68 0 top
R13  6.04,43.68 0 top
SJ1  46.61,46.22 0 top
SW1  38.8,56.07 90 top
SW2  28.39,9.27 180 top
TFT  25.47,53.15 180 bottom
TP1  22.17,36.45 90 top
TP2  22.8,34.41 90 top
TP3  15.44,6.54 180 top
TP4  22.23,3.11 180 top
TP5  38.55,52.51 0 top
TP28  28.71,3.04 180 top
TP29  35.44,6.54 180 top
U1  23.44,15.62 90 top
U2  30.55,43.18 90 top
U3  22.55,43.81 0 top
U4  11.73,57.47 30 top
U5  5.15,41.27 90 top
U$4  25.98,27.43 270 top
U$8  [HALLOWING_BACK]  50.87,0 0 bottom
U$12  [HALLOWING_FRONT]  0.07,0 0 top
U$13  4.26,33.4 90 top
U$31  34.36,57.53 180 top
U$32  16.58,57.53 180 top
U$34  46.8,50.16 180 top
U$35  21.54,11.89 180 top
VR2  4.39,47.75 270 top
X1  33.34,49.27 270 top
X3  25.47,55.62 180 top
X6  3.56,33.4 90 top

### Tracks (layer width: path | path; a pad name or v marks a point on that pad's centre or on a via)
!RESET  (via drill 0.5)
  Top 0.254: v37.41,56.13 37.53,56.26 38,56.26 | SW1.3 38,53.25 38.68,52.57 | 38.68,52.57 39.47,51.78 v39.47,50.03 | U$4.40 27.23,32.15 27.26,32.19 27.26,33.71 v28.1,34.54 | TP5.P$1 38.61,52.51 38.68,52.57
  Top 0.305: MS1.1' 12.26,54.35 v14.04,54.35 15.94,54.35 15.94,54.23 MS1.1 | SW1.1 38,56.26 SW1.3
  Bottom 0.254: v37.41,56.13 34.87,53.59 27.65,53.59 26.1,55.14 24.33,55.14 22.91,53.72 18.1,53.72 17.47,54.35 v14.04,54.35 | v28.1,34.54 28.33,34.31 29.33,34.31 29.42,34.39 29.44,34.39 29.96,34.91 29.96,35.12 30.41,35.58 31.2,35.58 31.6,35.18 32.85,35.18 34.44,33.59 37.22,33.59 39.12,35.49 39.12,42.92 42.61,46.42 42.61,47.24 39.82,50.03 v39.47,50.03
+3V3  (via drill 0.5)
  Top 0.305: v29.15,43.18 29.15,42.32 U2.5 29.23,42.21 C8.1 | IC4.16 IC4.15 IC4.14 28.63,20.68 IC4.13 28.51,21.5 v28.51,21.84 | IC4.16 28.63,18.68 IC4.1 29,18.31 29,17.93 29.41,17.53 29.41,16.8 29.1,16.5 R4.5 | U1.7 20.12,14.22 | 20.12,14.22 U1.8 20.12,11.11 LED1.2 | R4.5 29.5,16.41 30.42,15.49 30.87,15.49 R4.3 | U$4.44 25.23,31.99 25.09,32.13 25.09,35.05 v24.71,35.43 25.05,35.77 C7.1 23.71,36.68 22.87,37.52 v22.87,37.97 23.34,38.44 R9.8 23.34,40.16 | v22.02,14.22 20.12,14.22 | v24.48,43.46 24.2,43.18 24.2,41.65 23.4,40.85 R9.1 23.34,40.16 | IC4.16 29.92,19.18 30.92,20.18 IC4.8 | 18.8,51.49 C11.1 | v21.13,27.96 21.42,27.68 U$4.6 23.27,27.68 23.27,24.68 25.23,24.68 U$4.17 25.23,22.41 22.5,19.68 22.35,19.68 C5.1 22.1,18.03 v21.98,17.9 | C2.1 27.91,19.18 IC4.16 | U1.3 28.26,16.25 28.42,16.41 R4.5 | R4.5 R4.6 R4.7 R4.8 | U$4.36 30.06,30.18 v30.48,30.6 30.68,30.79 C4.1 | C11.1 18.64,51.18 MS1.2 15.94,50.67 12.13,50.67 MS1.2' 10.86,51.18 v9.21,49.53 | C11.1 18.99,51.46 v18.99,50.03 | SJ1.3 48.01,47.43 47.06,48.38 36.6,48.38 36.22,48.76 32.83,48.76 32.33,49.27 27.25,49.27 26.87,48.89 26.87,46.61 v26.48,46.22 | R9.4 20.74,40.29 21.02,40 22.42,40 | 22.42,40 23.18,40 23.34,40.16 | R9.2 22.44,40.02 22.42,40 | U4.2_C 13.78,57.88 v13.78,56.51
  Bottom 0.305: v29.15,43.18 29.15,42.92 | v18.99,50.03 21.28,47.75 22.8,47.75 25.09,45.46 | 25.09,45.46 27.37,43.18 v29.15,43.18 | 25.09,45.34 24.45,44.7 24.45,43.49 v24.48,43.46 | 25.09,45.34 25.09,45.46 | v30.48,30.6 30.48,28.64 28.51,26.66 v28.51,21.84 28.4,21.84 27.95,21.4 27.05,21.4 24.65,23.79 23.01,23.79 21.13,25.67 v21.13,27.96 23.31,30.14 23.31,31.75 22.93,32.13 22.17,32.13 21.66,32.64 21.66,34.16 22.93,35.43 v24.71,35.43 | TFT.4 28.27,42.29 v29.15,43.18 | v21.98,17.9 22.02,17.86 v22.02,14.22 | v26.48,46.22 25.98,46.22 25.09,45.34 | v22.87,37.97 22.67,38.17 TFT.11 TFT.10 | 13.78,56.64 v13.78,56.51 11.63,54.35 11.63,51.94 v9.21,49.53
A0
  Top 0.254: VR2.3 3.77,46.75 4.39,47.37 4.39,49.15 4.64,49.4 7.31,49.4 9.47,47.24 9.47,44.32 10.36,43.43 10.48,43.56 MS1.5' | MS1.5 17.19,42.57 18.05,42.57 18.51,42.11 18.51,40.21 18.97,39.76 18.97,38.02 19.42,37.56 19.42,35.61 20.62,34.41 20.62,30.55 21.07,30.09 21.07,29.85 21.74,29.18 U$4.3
  Top 0.305: MS1.5' MS1.5
A1  (via drill 0.5)
  Top 0.254: MS1.6 16.45,41.02 16.45,40.98 18.05,39.38 18.05,37.64 18.51,37.18 18.51,35.23 19.65,34.09 19.65,30.22 20.16,29.71 20.16,27.82 20.8,27.18 U$4.7 | MS1.6' 10.48,41.02 9.85,41.65 9.85,43.29 9.01,44.13 9.01,45.84 8.2,46.66 v8.2,47.37 | v7.69,50.29 7.37,50.61 R3.2 6.29,50.69 6.29,53.84 8.7,56.26 9.86,56.26 U4.1_E
  Top 0.305: MS1.6' MS1.6
  Bottom 0.254: v8.2,47.37 7.69,47.88 v7.69,50.29
A2  (via drill 0.5)
  Top 0.254: 17.09,38.48 MS1.7 | U$4.8 20.65,26.68 19.7,27.63 19.7,29.52 19.19,30.03 19.19,33.84 18.04,34.99 18.04,35.03 18.05,35.04 18.05,36.84 17.86,37.03 17.65,37.03 MS1.7 | 17.34,38.48 MS1.7 | MS1.7 15.05,37.33 v14.04,37.33 13.02,37.33 MS1.7'
  Bottom 0.254: v14.04,37.33 12.51,37.33 10.61,35.43 10.61,14.28 15.44,9.46 TP3.P$1
A3  (via drill 0.5)
  Top 0.254: U$4.9 20.51,26.18 19.25,27.44 19.25,29.33 18.74,29.84 18.74,33.65 16.49,35.9 16.24,35.9 MS1.8 v14.04,35.94
  Top 0.305: MS1.8' v14.04,35.94
  Bottom 0.254: TP4.P$1 22.23,2.79 20.77,4.25 20.77,9.95 17.26,13.46 13.28,13.46 11.4,15.33 11.37,15.36 11.37,33.4 13.91,35.94 v14.04,35.94
A4  (via drill 0.5)
  Top 0.254: U$4.10 21.15,25.68 20.96,25.68 20.36,25.68 19.94,26.1 18.74,27.3 18.74,29.19 18.28,29.65 18.28,33.09 17.98,33.4 MS1.9
  Top 0.305: MS1.9' v14.04,33.4 MS1.9
  Bottom 0.254: 28.71,4.51 TP28.P$1 28.96,2.28 | 13.4,33.4 v14.04,33.4 12.9,33.4 12.01,32.51 12.01,15.74 13.4,14.35 18.61,14.35 28.96,4 28.96,2.28 | 28.96,2.09 28.96,2.28
A5  (via drill 0.5)
  Top 0.254: v14.04,24.51 17.8,24.51 18.47,25.18 U$4.11
  Top 0.305: MS1.10' v14.04,30.86 MS1.10 16.45,30.86
  Bottom 0.254: v14.04,30.86 13.91,30.86 12.64,29.59 12.64,25.65 13.78,24.51 v14.04,24.51 15.18,23.36 15.18,19.75 24.45,10.47 27.25,10.47 31.69,6.03 TP29.P$1
AREF  (via drill 0.5)
  Top 0.254: U$4.4 21.53,28.68 20.62,29.59 20.62,29.9 20.16,30.36 20.16,34.22 18.97,35.42 18.97,37.37 18.51,37.83 18.51,39.57 18.05,40.02 18.05,41.92 17.86,42.11 14.22,42.11 v14.04,42.29 | C14.1 18.95,48.04 v18.42,48.57 18.36,48.64 MS1.3
  Top 0.305: MS1.3' MS1.3
  Bottom 0.254: v14.04,42.29 18.23,46.48 18.23,48.38 v18.42,48.57
BACKLITE  (via drill 0.5)
  Top 0.254: Q3.1 24.45,38.9 24.45,38.03 24.43,38.03 v24.03,37.63 | R9.6 21.66,39.13 21.66,38.73 20.78,37.85 v20.78,37.08 20.78,35.69 21.61,34.86 21.61,30.85 22.28,30.18 U$4.1
  Bottom 0.254: v24.03,37.63 23.48,37.08 v20.78,37.08
CHG_LED
  Top 0.254: R2.2 21.53,42.58 U3.1
CHG_RATE
  Top 0.254: 21.57,45.14 U3.5 21.6,46.07 R8.1
D2
  Top 0.254: IC4.11 29.98,21.52 28.23,23.27 U$4.23
D3  (via drill 0.5)
  Top 0.254: v23.6,22 23.93,22.32 23.94,22.32 24.73,23.11 U$4.16 | v44.39,29.97 44.39,30.6 D2.C 45.53,33.23 R6.2
  Bottom 0.254: v23.6,22 24.04,22 27.25,18.79 29.91,18.79 30.74,19.62 30.74,23.11 30.17,23.68 30.17,25.52 30.8,26.16 38.55,26.16 42.36,29.97 v44.39,29.97
D4
  Top 0.203: 6.16,28.23 6.16,29.21 6.29,29.33 9.09,29.33 10.03,28.39 10.03,22.87 | 6.16,28.23 R5.2 | D1.C 6,28.06 6.16,28.23
  Top 0.254: 23.23,24.04 U$4.13 22.88,23.95 22.67,23.75 20.96,23.75 20.53,23.31 19.45,23.31 18.17,22.03 10.33,22.03 10.03,22.34 10.03,22.87
D5
  Top 0.254: U$4.24 28.73,23.79 28.77,23.75 31.12,23.75 32.39,22.48 32.39,21.9 33.6,20.7 MS1.19 | 33.34,20.57 34.61,20.57 MS1.19 | MS1.19 MS1.19'
D6
  Top 0.254: U$4.27 32.55,25.68 32.89,25.35 32.89,24.71 34.36,23.24 MS1.20 MS1.20'
D8_NEOPIX
  Top 0.254: LED1.1 23.06,9.92 23.06,16.51 24.07,17.52 24.07,19.25 26.1,21.28 26.55,21.28 27.23,21.96 U$4.21
D9
  Top 0.254: MS1.21 34.34,26.18 U$4.28
  Top 0.305: MS1.21 MS1.21'
D10
  Top 0.254: 34.87,28.32 MS1.22 34.39,28.32 32.75,26.68 U$4.29 | 34.87,28.32 MS1.22' | 34.36,28.83 34.87,28.32
D11
  Top 0.254: 34.18,30.86 MS1.23 34.74,30.73 33.42,29.41 33.08,29.41 32.83,29.17 32.83,27.56 32.46,27.18 U$4.30
  Top 0.305: MS1.23 35.37,30.86 MS1.23'
D12
  Top 0.254: MS1.24' MS1.24 34.53,33.4 32.89,31.76 32.89,29.86 32.38,29.35 32.38,27.74 32.31,27.68 U$4.31
D13  (via drill 0.5)
  Top 0.254: 39.18,35.81 38.68,35.81 38.55,35.94 v36.9,35.94 MS1.25 34.49,35.94 32.89,34.34 32.89,32.4 32.43,31.95 32.43,30.05 31.92,29.54 31.92,28.19 31.91,28.18 U$4.32 | 39.57,35.81 39.18,35.81 | 39.18,35.81 MS1.25' | R7.1 36.52,54.35 37.03,53.84 37.03,51.81 v35.76,50.54
  Bottom 0.254: v36.9,35.94 38.07,37.11 38.07,38.7 35.31,41.46 35.31,45.21 34.29,46.22 34.29,48.26 35.76,49.72 v35.76,50.54
D+  (via drill 0.5)
  Top 0.254: X3.D+ 25.47,53.72 v25.09,53.34 | v31.56,36.32 31.84,36.04 31.84,32.65 31.51,32.32 31.51,30.43 31.01,29.92 31.01,29.4 30.79,29.18 U$4.34
  Bottom 0.254: v25.09,53.34 25.09,52.34 25.89,51.54 26.35,51.54 31.62,46.27 31.62,36.37 v31.56,36.32
D-  (via drill 0.5)
  Top 0.254: X3.D- 26.12,52.42 v26.22,52.32 | v32.55,37.08 32.55,34.65 32.43,34.53 32.43,32.59 31.97,32.14 31.97,30.24 31.46,29.73 31.46,28.7 31.44,28.68 U$4.33
  Bottom 0.254: v26.22,52.32 32.07,46.46 32.07,37.21 32.55,36.73 v32.55,37.08
EN  (via drill 0.5)
  Top 0.254: U2.3 32.52,44.13 32.83,43.81 32.83,41.4 | v36.77,11.93 36.77,11.55 34.49,9.27 31.14,9.27 30.25,8.39 29.03,8.39 28.39,7.74 SW2.P1 | MS1.27' 40.07,41.02 40.96,40.13 40.96,36.83 42.23,35.56 v42.99,35.56 | 32.83,41.4 32.1,40.67 R1.4 | 32.83,41.4 33.22,41.02 MS1.27 35.37,41.02
  Top 0.305: 35.37,41.02 35.88,40.51 38.8,40.51 39.25,40.95 | 39.25,40.95 MS1.27' | 39.5,40.95 39.25,40.95
  Bottom 0.254: v36.77,11.93 36.77,13.33 37.53,14.09 38.78,14.09 45.71,21.03 45.71,32.89 44.72,33.88 44.7,33.88 44.24,34.34 44.24,34.36 43.05,35.56 v42.99,35.56
FLASH_CS  (via drill 0.5)
  Top 0.254: U$4.12 20.69,24.68 v20.13,24.13 | v24.96,13.65 24.9,13.71 U1.1 27.88,13.71 28.39,13.2 29.79,13.2 30.04,13.46 30.04,14.47 30.28,14.71 R4.2
  Bottom 0.254: v24.96,13.65 25.21,13.9 25.21,16.82 21.15,20.89 21.15,23.11 v20.13,24.13
FLASHMISO
  Top 0.254: U1.2 24.07,14.98 23.51,15.54 23.51,16.27 24.58,17.33 24.58,19.11 26.29,20.82 26.74,20.82 27.68,21.77 27.68,23.91 U$4.22
FLASHMOSI
  Top 0.254: U$4.19 26.23,22.32 26.1,22.2 25.73,22.2 23.16,19.63 23.16,17.95 22.09,16.89 21.53,16.89 20.9,17.52 U1.5
FLASHSCK
  Top 0.254: 20.9,16.25 U1.6 20.18,16.19 22.04,16.19 23.61,17.76 23.61,19.44 25.92,21.74 26.36,21.74 26.73,22.11 U$4.20
GND  (via drill 0.5)
  Top 0.254: MS1.16 14.58,15.62 14.57,15.61 13.51,15.61 13.5,15.62 MS1.16' | U$4.35 27.72,29.68 25.98,27.94 U$4.THERMAL | U$4.18 25.73,27.18 U$4.THERMAL | 25.71,28.18 U$4.5 | 25.72,28.19 25.71,28.18 | C6.2 21.47,49.01 | U$4.42 26.23,27.68 U$4.THERMAL | U$4.THERMAL 25.98,27.91 25.71,28.18 | U$4.THERMAL v27.75,29.21 | C4.2 29.81,34.41 29.79,34.41 | LED1.4 25.86,6.44 SW2.S1 | D1.A v0.96,28.06 | 22.44,42.4 U3.2 | R9.3 21.64,41.09 21.1,41.63 20.37,41.63 v19.31,40.57 | IC4.7 31.82,19.68 32.07,19.94 32.07,20.19 | C2.2 25.82,17.8 25.95,17.67
  Top 0.305: MS1.16 17.34,15.62 18.53,16.81 18.53,19.29 18.67,19.43 C5.2 | SW2.S1 25.89,8.72 24.64,9.97 24.64,12.25 23.94,12.95 v23.94,14.16 | SW2.O2 32.98,14.16 33.85,14.16 | PIR.1 7.28,18.12 9.85,15.55 11.56,15.55 MS1.16' | U1.4 26.1,17.52 25.95,17.67 | C10.2 49.79,30.28 49.33,29.83 I2C.NC1
  Bottom 0.254: 27.6,39.21 27.35,38.96 27.35,37.48 27.75,37.08 v29.53,37.08 | v0.96,28.06 0.83,28.19 0.83,37.59 v2.61,39.37
  other vias: 22.55,43.94 34.42,50.8 39.44,56 14.04,49.78 14.04,44.83 48.9,20.13 1.34,48 4.77,46.48 5.02,39.75 30.42,45.97 41.6,30.48 43.63,43.18 43.82,45.34 43.63,28.57 48.84,28.06 49.6,39.75 27.37,20.32 29.53,20.06 31.69,17.27 24.2,29.21 26.99,25.65 24.2,25.65 18.74,44.07 22.36,20.89 24.33,15.87 36.9,44.51 38.87,46.54 37.09,49.91 20.07,21.02 20.96,49.97 4.58,51.88 17.98,55.31 29.79,22.86 31.82,21.02 45.03,34.67 41.41,34.73 8.13,44.95 7.69,38.03 0.96,44.38 3.05,50.35 14.55,59.24 36.84,34.67 36.84,32.13 36.84,27.11 36.84,24.44 28.52,17.27 32.39,13.84 43.06,19.87 29.53,51.56 36.52,59.05 9.66,54.8
  pour Top: 0.07,60.07 50.87,60.07 50.87,12.7 24.2,12.7 17.28,20.63 17.28,40.26 17.02,40.51 17.02,40.76 16.77,41.02 9.66,41.02 9.28,40.64 9.28,38.54 8.32,37.59 0.7,37.59 0.07,38.22
  pour Bottom: 0.07,60.07 50.87,60.07 50.87,12.7 24.2,12.7 24.26,13.27 19.12,18.41 19.12,22.29 21.21,24.25 23.75,24.25 23.75,33.91 17.02,40.51 17.02,40.76 16.77,41.02 9.66,41.02 9.28,40.64 9.28,38.54 8.32,37.59 0.7,37.59 0.07,38.22
MISO  (via drill 0.5)
  Top 0.254: v18.48,23.58 18.14,23.24 MS1.13 | U$4.48 22.89,31.24 v22.44,31.24
  Top 0.305: MS1.13' MS1.13
  Bottom 0.254: v18.48,23.58 18.48,24.5 19.88,25.9 19.88,28.68 v22.44,31.24
MOSI  (via drill 0.5)
  Top 0.254: v29.41,33.52 29.41,32.13 28.73,31.45 U$4.37 | MS1.12' 12.64,25.78 v13.91,27.05 15.18,25.78 MS1.12
  Bottom 0.254: v13.91,27.05 15.56,28.7 15.56,38.99 18.74,42.16 24.14,42.16 25.07,41.23 TFT.8 25.07,39.37 25.98,38.46 25.98,36.91 27.23,35.67 27.23,34.18 27.77,33.63 29.3,33.63 v29.41,33.52
N$1
  Top 0.254: CHG.C 19.63,52.99 20.01,52.61 20.01,50.38 20.03,50.36 20.03,49.71 19.88,49.56 19.88,44.53 R2.1
N$2
  Top 0.254: L.A 33.42,54.35 R7.2
N$3
  Top 0.305: 45.66,46.22 46.17,46.22
N$6  (via drill 0.5)
  Top 0.254: Q3.3 27.61,38.75 v28.39,37.97
  Bottom 0.254: TFT.3 29.07,38.65 v28.39,37.97
N$8  (via drill 0.5)
  Top 0.254: SW2.S2 27.8,10.16 v33.09,10.16 33.34,10.16 | D4.C 23.13,52.93 v22.42,52.93
  Top 0.305: 24.39,51.67 D4.C 23.87,51.05 Q2.2 Q1.2
  Bottom 0.254: v33.09,10.16 36.14,10.16 46.68,20.7 46.68,45.59 39.18,53.08 27.51,53.08 25.91,54.68 24.52,54.68 22.77,52.93 v22.42,52.93
N$19
  Top 0.254: R12.2 3.84,43.09 4.13,42.8 6.8,42.8 U5.4
N$20
  Top 0.254: U5.3 8.14,41.6 8.45,41.91 8.45,42.54 7.31,43.68 R13.2
N$21
  Top 0.254: C9.1 R12.1
N$22
  Top 0.254: R13.1 C13.1
N$23
  Top 0.254: VR2.2 6.89,46.9 C13.2
NEOPIXELOUT
  Top 0.254: R6.1 43.8,37.48 NEOPIXEL.3
ON/OFF  (via drill 0.5)
  Top 0.254: Q2.1 25.74,51.08 v25.24,51.08 | v37.79,13.2 37.41,13.59 33.34,13.59 32.33,12.57 32.33,11.17 31.95,10.79 29.67,10.79 SW2.P2
  Bottom 0.254: v25.24,51.08 24.07,52.25 24.07,53.59 24.71,54.23 25.72,54.23 27.37,52.57 38.93,52.57 46.17,45.34 46.17,20.84 38.54,13.2 v37.79,13.2
RX
  Top 0.254: U$4.14 23.73,23.4 23.56,23.24 21.1,23.24 20.71,22.86 19.64,22.86 17.64,20.86 16.36,20.86 MS1.14
  Top 0.305: MS1.14' MS1.14
SCK  (via drill 0.5)
  Top 0.254: MS1.11 16.58,28.32 v18.86,26.03 | v28.62,32.66 28.23,32.26 U$4.38
  Top 0.305: MS1.11' MS1.11
  Bottom 0.254: v18.86,26.03 16.13,28.76 16.13,38.67 19.14,41.67 23.82,41.67 24.27,41.22 TFT.9 | 24.33,40.23 TFT.9 | TFT.9 24.27,39.36 25.52,38.11 25.52,36.73 26.77,35.48 26.77,33.86 27.97,32.66 v28.62,32.66
SCL
  Top 0.254: 34.23,18.16 33.6,18.16 | 41.51,21.12 40.54,22.09 33.09,22.09 33.09,22.14 32.89,22.34 32.89,23.43 32.43,23.89 32.43,25.02 32.27,25.18 U$4.26 | 41.51,21.12 41.52,21.11 | IC4.4 30.48,16.82 R4.4 32.48,16.41 34.23,18.16 | 34.23,18.16 MS1.18 35.88,18.16 36.01,18.28 37.91,18.28 38.3,17.9 39.06,17.9 MS1.18' 40.77,18.16 41.51,18.9 41.51,21.12 | I2C.4 41.52,21.13 41.51,21.12
SDA  (via drill 0.5)
  Top 0.254: MS1.17' 42.11,15.62 46.8,20.32 46.8,22.6 46.28,23.13 I2C.3 42.09,23.13 | U$4.25 30.25,24.68 30.53,24.4 v31.64,24.4 | 31.09,13.81 R4.1 31.22,13.81 32.39,14.98 v32.39,15.05 33.91,15.05 MS1.17 | MS1.17 34.1,15.62 | MS1.17 34.61,15.62 35.12,15.11 | IC4.6 32.46,19.18 v32.69,19.41
  Top 0.305: 35.12,15.11 38.93,15.11 38.93,15.24 MS1.17'
  Bottom 0.254: v32.39,15.05 32.69,15.34 v32.69,19.41 32.69,23.35 v31.64,24.4
SENSORIN
  Top 0.203: R5.1 8.03,24.59 PIR.3
SPKR+
  Top 0.254: U5.5 5.32,42.25 6.16,41.4 6.16,35.49 X6.2 6.89,34.02 U$13.1
SPKR-
  Top 0.254: 5.15,32.4 X6.1 | U5.8 4.77,38.48 4.77,35.43 3.88,34.54 3.88,33.27 4.75,32.4 5.15,32.4 | 5.15,32.4 U$13.2
SWCLK
  Top 0.254: U$4.45 24.73,31.81 24.54,31.99 24.54,34.22 22.32,36.45 TP1.P$1 21.66,36.95 21.66,37.96 22.44,38.74 R9.7
SWDIO
  Top 0.254: U$4.46 24.23,31.66 23.7,32.18 23.7,33.51 TP2.P$1
TFT_CS  (via drill 0.5)
  Top 0.254: U$4.2 21.95,29.68 21.66,29.97 21.66,30.15 21.15,30.66 21.15,34.67 19.88,35.94 19.88,37.75 v19.88,38.35 19.88,38.42 20,38.42 R9.5
  Bottom 0.254: TFT.12 21.87,39.26 20.96,38.35 v19.88,38.35
TFT_DC  (via drill 0.5)
  Top 0.254: U$4.41 26.73,32.3 26.81,32.38 26.81,34.48 28.14,35.81 v28.14,35.75
  Bottom 0.254: TFT.7 25.87,39.37 26.44,38.8 26.44,37.1 27.38,36.17 27.72,36.17 v28.14,35.75
TFT_RESET  (via drill 0.5)
  Top 0.254: U$4.39 27.73,32.99 29.12,34.38 v29.12,35.18
  Bottom 0.254: v29.12,35.18 29.12,35.97 28.47,36.62 27.57,36.62 26.89,37.29 26.89,39.02 26.67,39.25 TFT.6
TX
  Top 0.254: 16.89,18.16 MS1.15 16.45,18.2 18.05,19.8 18.05,20.62 19.83,22.4 20.9,22.4 21.29,22.78 23.75,22.78 24.23,23.25 U$4.15
  Top 0.305: MS1.15' 12.39,18.16 12.64,18.41 16.32,18.41 16.45,18.28 MS1.15
V+  (via drill 0.5)
  Top 0.305: C15.1 1.71,41.6 U5.6 4.57,41.6 v5.15,41.02 | U5.1 7.35,39.41 v7.18,39.24 | 3.75,21.84 v3.69,21.78 7.21,21.78 PIR.2 | Q2.3 v25.21,49.85 | C6.1 22.86,49.84 v23.06,50.03 | R1.5 30.29,40.75 30.29,42.22 | 30.29,42.22 30.29,44.64 29.02,45.91 v29.02,46.22 30.1,47.3 35.46,47.3 35.6,47.44 v35.63,47.41 | U2.1 30.29,42.22 | SJ1.1 42.49,46.22 v41.72,46.99
  Bottom 0.305: v3.69,21.78 3.69,39.81 4.89,41.02 v5.15,41.02 5.4,41.02 v7.18,39.24 7.18,40.38 16.71,49.91 16.71,51.43 18.1,52.83 21.15,52.83 23.06,50.92 v23.06,50.03 23.24,49.85 v25.21,49.85 27.18,49.85 29.02,48 v29.02,46.22 | v35.63,47.41 35.63,47.43 35.82,47.62 41.09,47.62 v41.72,46.99
VBAT
  Top 0.305: 35.5,43.56 MS1.28 34.61,43.68 37.72,43.68 | MS1.28' 39.18,43.43 38.04,43.43 37.79,43.68 37.72,43.68 | 25.07,45.61 Q1.3 | 37.72,43.68 37.72,46.54 36.01,48.26 29.66,48.26 X1.2 27.9,48.27 27.76,48.14 27.76,45.34 | Q1.3 24.85,45.61 24.2,44.95 24.2,44.38 23.5,43.68 U3.3 | R1.8 29.56,38.07 29.15,38.48 29.15,40.76 28.9,41.02 26.99,41.02 26.74,41.27 26.74,43.12 C3.1 27.76,44.14 27.76,45.34 | Q1.3 25.48,45.34 27.76,45.34
VBATT  (via drill 0.5)
  Top 0.254: R1.2 R1.1 31.91,37.8 30.74,36.64 v30.74,34.79 | U$4.47 23.73,31.39 22.5,32.61 v22.5,33.02
  Bottom 0.254: v30.74,34.79 30.74,33.46 28.9,31.62 24.15,31.62 22.75,33.02 v22.5,33.02
VBUS  (via drill 0.5)
  Top 0.254: X3.VBUS 26.65,54.97 26.65,55.78 26.61,55.81
  Top 0.305: MS1.26' v36.9,38.48 MS1.26 | X3.VBUS 26.77,53 D4.A 27.57,51.94 | 27.57,51.94 27.57,51.63 26.87,50.92 26.87,49.91 26.16,49.21 26.16,47.75 | 34.58,38.32 MS1.26 | 23.59,45.11 U3.4 23.5,45.52 24.72,46.74 24.73,46.74 24.96,46.97 24.96,47.24 25.47,47.75 26.16,47.75 | R1.3 31.93,39.75 32.83,39.75 34.1,38.48 MS1.26 | 26.16,47.75 Q1.1 | v32.96,50.54 32.96,50.67 30.8,52.83 28.46,52.83 27.57,51.94 | CHG.A 20.04,59.11 23.31,59.11 23.75,58.67 23.75,56.51 24.14,56.13 26.29,56.13 26.61,55.81
  Bottom 0.305: v32.96,50.54 32.96,49.91 33.77,49.09 33.77,46.04 34.79,45.02 34.79,41.27 36.9,39.16 v36.9,38.48
VCC
  Top 0.305: I2C.2 46.41,25.13 46.68,25.4 46.68,30.98 47.69,32 C10.1 47.89,31.83 46.68,33.04 46.68,38.73 45.79,39.62 | 45.79,39.62 NEOPIXEL.2 | SJ1.2 46.61,40.45 45.79,39.62
VDDCORE
  Top 0.254: U$4.43 25.72,32.76 25.98,33.02 C1.1

### Text on the board
tPlace: SCL | SDA